# EAGLE schematic RGB_matrixDriver-v2.0 (EAGLE 7.3.0)
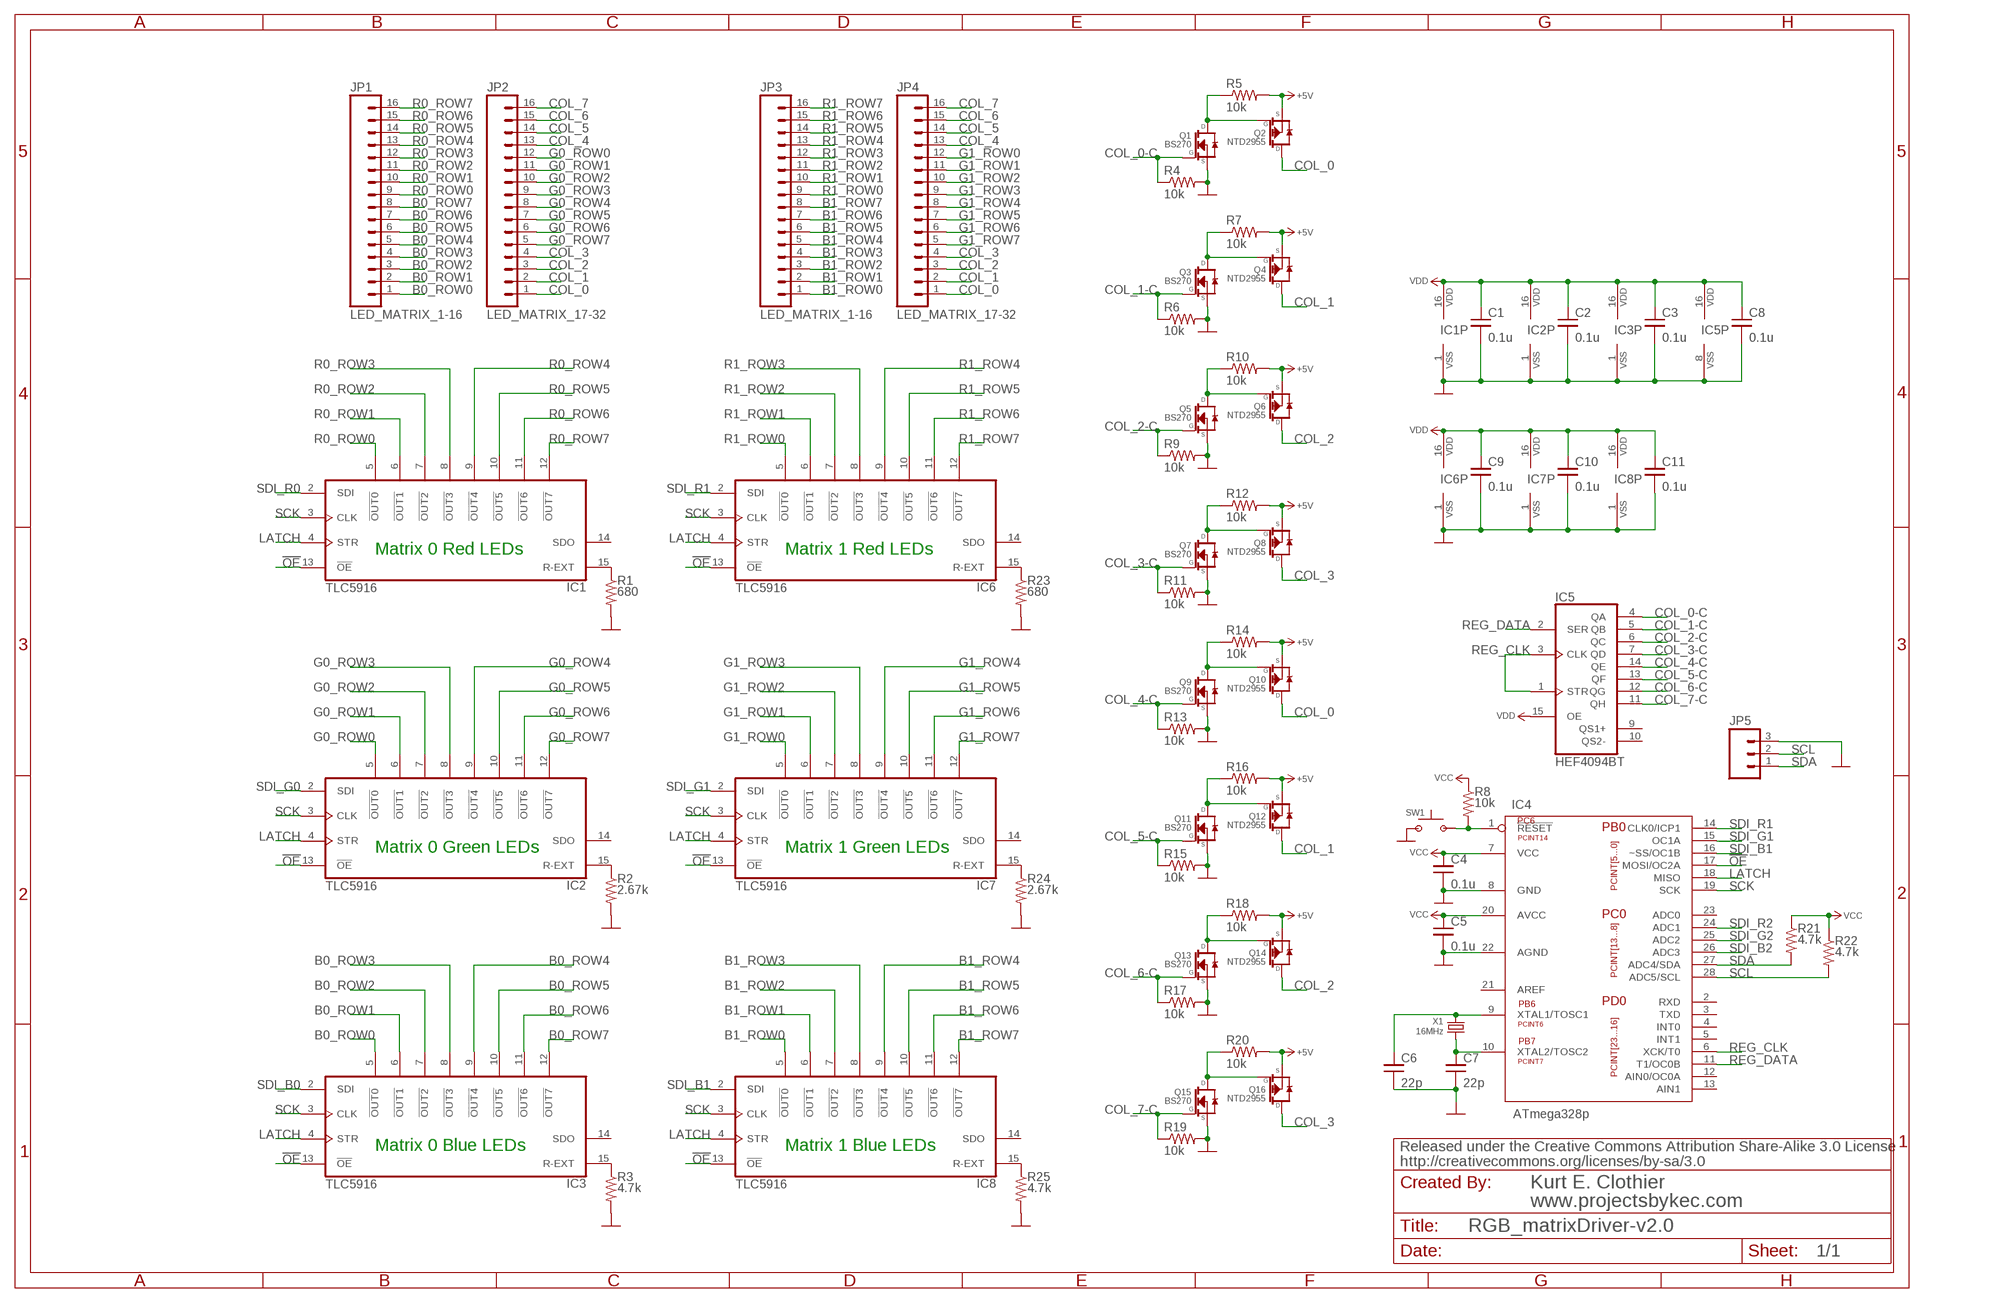
[diagram p0: schematic, sheet 1]

## Parts
C1  0.1u  CAPACITOR-0805  [0805]
C2  0.1u  CAPACITOR-0805  [0805]
C3  0.1u  CAPACITOR-0805  [0805]
C4  0.1u  CAPACITOR-0805  [0805]
C5  0.1u  CAPACITOR-0805  [0805]
C6  22p  CAPACITOR-0805  [0805]
C7  22p  CAPACITOR-0805  [0805]
C8  0.1u  CAPACITOR-0805  [0805]
C9  0.1u  CAPACITOR-0805  [0805]
C10  0.1u  CAPACITOR-0805  [0805]
C11  0.1u  CAPACITOR-0805  [0805]
IC1  TLC5916  TLC591XBT  [SO16]
IC2  TLC5916  TLC591XBT  [SO16]
IC3  TLC5916  TLC591XBT  [SO16]
IC4  ATmega328p  MEGA48/88/168/328-PU-SOCKET  [28P3-SOCKET]
IC5  HEF4094BT  [SO16]
IC6  TLC5916  TLC591XBT  [SO16]
IC7  TLC5916  TLC591XBT  [SO16]
IC8  TLC5916  TLC591XBT  [SO16]
JP1  LED_MATRIX_1-16  M16LOCK_LONGPADS  [1X16_LOCK_LONGPADS]
JP2  LED_MATRIX_17-32  M16LOCK_LONGPADS  [1X16_LOCK_LONGPADS]
JP3  LED_MATRIX_1-16  M16LOCK_LONGPADS  [1X16_LOCK_LONGPADS]
JP4  LED_MATRIX_17-32  M16LOCK_LONGPADS  [1X16_LOCK_LONGPADS]
JP5  M03LOCK  [1X03_LOCK]
Q1  BS270  [TO-92]
Q2  NTD2955  [TO-251_(IPAK)]
Q3  BS270  [TO-92]
Q4  NTD2955  [TO-251_(IPAK)]
Q5  BS270  [TO-92]
Q6  NTD2955  [TO-251_(IPAK)]
Q7  BS270  [TO-92]
Q8  NTD2955  [TO-251_(IPAK)]
Q9  BS270  [TO-92]
Q10  NTD2955  [TO-251_(IPAK)]
Q11  BS270  [TO-92]
Q12  NTD2955  [TO-251_(IPAK)]
Q13  BS270  [TO-92]
Q14  NTD2955  [TO-251_(IPAK)]
Q15  BS270  [TO-92]
Q16  NTD2955  [TO-251_(IPAK)]
R1  680  RESISTOR-V-0805  [0805]
R2  2.67k  RESISTOR-V-0805  [0805]
R3  4.7k  RESISTOR-V-0805  [0805]
R4  10k  RESISTOR-0805  [0805]
R5  10k  RESISTOR-0805  [0805]
R6  10k  RESISTOR-0805  [0805]
R7  10k  RESISTOR-0805  [0805]
R8  10k  RESISTOR-V-0805  [0805]
R9  10k  RESISTOR-0805  [0805]
R10  10k  RESISTOR-0805  [0805]
R11  10k  RESISTOR-0805  [0805]
R12  10k  RESISTOR-0805  [0805]
R13  10k  RESISTOR-0805  [0805]
R14  10k  RESISTOR-0805  [0805]
R15  10k  RESISTOR-0805  [0805]
R16  10k  RESISTOR-0805  [0805]
R17  10k  RESISTOR-0805  [0805]
R18  10k  RESISTOR-0805  [0805]
R19  10k  RESISTOR-0805  [0805]
R20  10k  RESISTOR-0805  [0805]
R21  4.7k  RESISTOR-V-0805  [0805]
R22  4.7k  RESISTOR-V-0805  [0805]
R23  680  RESISTOR-V-0805  [0805]
R24  2.67k  RESISTOR-V-0805  [0805]
R25  4.7k  RESISTOR-V-0805  [0805]
SW1  SPST_OFF-MOM-TACTILE-PTH  [TACTILE-PTH]
X1  16MHz  CRYSTALSMD-10.5X4.8  [CRYSTAL-SMD-10.5X4.8-2PIN]

## Nets
!OE: IC1.13(!OE) IC2.13(!OE) IC3.13(!OE) IC4.17(MOSI/OC2A) IC6.13(!OE) IC7.13(!OE) IC8.13(!OE)
+5V: Q2.3(S) Q4.3(S) Q6.3(S) Q8.3(S) Q10.3(S) Q12.3(S) Q14.3(S) Q16.3(S) R5.2 R7.2 R10.2 R12.2 R14.2 R16.2 R18.2 R20.2
B0_ROW0: IC3.5(!OUT0) JP1.1
B0_ROW1: IC3.6(!OUT1) JP1.2
B0_ROW2: IC3.7(!OUT2) JP1.3
B0_ROW3: IC3.8(!OUT3) JP1.4
B0_ROW4: IC3.9(!OUT4) JP1.5
B0_ROW5: IC3.10(!OUT5) JP1.6
B0_ROW6: IC3.11(!OUT6) JP1.7
B0_ROW7: IC3.12(!OUT7) JP1.8
B1_ROW0: IC8.5(!OUT0) JP3.1
B1_ROW1: IC8.6(!OUT1) JP3.2
B1_ROW2: IC8.7(!OUT2) JP3.3
B1_ROW3: IC8.8(!OUT3) JP3.4
B1_ROW4: IC8.9(!OUT4) JP3.5
B1_ROW5: IC8.10(!OUT5) JP3.6
B1_ROW6: IC8.11(!OUT6) JP3.7
B1_ROW7: IC8.12(!OUT7) JP3.8
COL_0: JP2.1 JP4.1 Q2.2(D) Q10.2(D)
COL_0-C: IC5.4(QA) Q1.2(G) R4.1
COL_1: JP2.2 JP4.2 Q4.2(D) Q12.2(D)
COL_1-C: IC5.5(QB) Q3.2(G) R6.1
COL_2: JP2.3 JP4.3 Q6.2(D) Q14.2(D)
COL_2-C: IC5.6(QC) Q5.2(G) R9.1
COL_3: JP2.4 JP4.4 Q8.2(D) Q16.2(D)
COL_3-C: IC5.7(QD) Q7.2(G) R11.1
COL_4: JP2.13 JP4.13
COL_4-C: IC5.14(QE) Q9.2(G) R13.1
COL_5: JP2.14 JP4.14
COL_5-C: IC5.13(QF) Q11.2(G) R15.1
COL_6: JP2.15 JP4.15
COL_6-C: IC5.12(QG) Q13.2(G) R17.1
COL_7: JP2.16 JP4.16
COL_7-C: IC5.11(QH) Q15.2(G) R19.1
G0_ROW0: IC2.5(!OUT0) JP2.12
G0_ROW1: IC2.6(!OUT1) JP2.11
G0_ROW2: IC2.7(!OUT2) JP2.10
G0_ROW3: IC2.8(!OUT3) JP2.9
G0_ROW4: IC2.9(!OUT4) JP2.8
G0_ROW5: IC2.10(!OUT5) JP2.7
G0_ROW6: IC2.11(!OUT6) JP2.6
G0_ROW7: IC2.12(!OUT7) JP2.5
G1_ROW0: IC7.5(!OUT0) JP4.12
G1_ROW1: IC7.6(!OUT1) JP4.11
G1_ROW2: IC7.7(!OUT2) JP4.10
G1_ROW3: IC7.8(!OUT3) JP4.9
G1_ROW4: IC7.9(!OUT4) JP4.8
G1_ROW5: IC7.10(!OUT5) JP4.7
G1_ROW6: IC7.11(!OUT6) JP4.6
G1_ROW7: IC7.12(!OUT7) JP4.5
GND-D: C1.2 C2.2 C3.2 C4.2 C5.2 C6.2 C7.2 C8.2 C9.2 C10.2 C11.2 IC1.1(VSS) IC2.1(VSS) IC3.1(VSS) IC4.8(GND) IC4.22(AGND) IC5.8(VSS) IC6.1(VSS) IC7.1(VSS) IC8.1(VSS) Q1.3(S) Q3.3(S) Q5.3(S) Q7.3(S) Q9.3(S) Q11.3(S) Q13.3(S) Q15.3(S) R1.2 R2.2 R3.2 R4.2 R6.2 R9.2 R11.2 R13.2 R15.2 R17.2 R19.2 R23.2 R24.2 R25.2 SW1.1 SW1.2 ; supply symbol labelled GND-DIGITAL
LATCH: IC1.4(STR) IC2.4(STR) IC3.4(STR) IC4.18(MISO) IC6.4(STR) IC7.4(STR) IC8.4(STR)
N$1: IC3.15(R-EXT) R3.1
N$2: Q1.1(D) Q2.1(G) R5.1
N$3: IC2.15(R-EXT) R2.1
N$4: Q3.1(D) Q4.1(G) R7.1
N$5: IC1.15(R-EXT) R1.1
N$6: Q5.1(D) Q6.1(G) R10.1
N$7: Q7.1(D) Q8.1(G) R12.1
N$8: Q9.1(D) Q10.1(G) R14.1
N$9: C6.1 IC4.9(XTAL1/TOSC1) X1.P$2
N$10: IC4.1(!RESET) R8.2 SW1.3 SW1.4
N$11: IC6.15(R-EXT) R23.1
N$12: IC7.15(R-EXT) R24.1
N$13: IC8.15(R-EXT) R25.1
N$14: JP5.3 ; supply symbol labelled GND-DIGITAL
N$15: C7.1 IC4.10(XTAL2/TOSC2) X1.P$1
N$17: Q11.1(D) Q12.1(G) R16.1
N$18: Q13.1(D) Q14.1(G) R18.1
N$19: Q15.1(D) Q16.1(G) R20.1
R0_ROW0: IC1.5(!OUT0) JP1.9
R0_ROW1: IC1.6(!OUT1) JP1.10
R0_ROW2: IC1.7(!OUT2) JP1.11
R0_ROW3: IC1.8(!OUT3) JP1.12
R0_ROW4: IC1.9(!OUT4) JP1.13
R0_ROW5: IC1.10(!OUT5) JP1.14
R0_ROW6: IC1.11(!OUT6) JP1.15
R0_ROW7: IC1.12(!OUT7) JP1.16
R1_ROW0: IC6.5(!OUT0) JP3.9
R1_ROW1: IC6.6(!OUT1) JP3.10
R1_ROW2: IC6.7(!OUT2) JP3.11
R1_ROW3: IC6.8(!OUT3) JP3.12
R1_ROW4: IC6.9(!OUT4) JP3.13
R1_ROW5: IC6.10(!OUT5) JP3.14
R1_ROW6: IC6.11(!OUT6) JP3.15
R1_ROW7: IC6.12(!OUT7) JP3.16
REG_CLK: IC4.6(XCK/T0) IC5.1(STR) IC5.3(CLK)
REG_DATA: IC4.11(T1/OC0B) IC5.2(SER)
SCK: IC1.3(CLK) IC2.3(CLK) IC3.3(CLK) IC4.19(SCK) IC6.3(CLK) IC7.3(CLK) IC8.3(CLK)
SCL: IC4.28(ADC5/SCL) JP5.2 R22.2
SDA: IC4.27(ADC4/SDA) JP5.1 R21.2
SDI_B0: IC3.2(SDI)
SDI_B1: IC4.16(~SS/OC1B) IC8.2(SDI)
SDI_B2: IC4.26(ADC3)
SDI_G0: IC2.2(SDI)
SDI_G1: IC4.15(OC1A) IC7.2(SDI)
SDI_G2: IC4.25(ADC2)
SDI_R0: IC1.2(SDI)
SDI_R1: IC4.14(CLK0/ICP1) IC6.2(SDI)
SDI_R2: IC4.24(ADC1)
VCC: C4.1 C5.1 IC4.7(VCC) IC4.20(AVCC) R8.1 R21.1 R22.1
VDD: C1.1 C2.1 C3.1 C8.1 C9.1 C10.1 C11.1 IC1.16(VDD) IC2.16(VDD) IC3.16(VDD) IC5.15(OE) IC5.16(VDD) IC6.16(VDD) IC7.16(VDD) IC8.16(VDD)
Unconnected: IC1.14(SDO) IC2.14(SDO) IC3.14(SDO) IC4.2(RXD) IC4.3(TXD) IC4.4(INT0) IC4.5(INT1) IC4.12(AIN0/OC0A) IC4.13(AIN1) IC4.21(AREF) IC4.23(ADC0) IC5.9(QS1+) IC5.10(QS2-) IC6.14(SDO) IC7.14(SDO) IC8.14(SDO)

## Notes on the sheet
- Matrix 0 Red LEDs | Matrix 1 Red LEDs
- Matrix 0 Green LEDs | Matrix 1 Green LEDs
- Matrix 0 Blue LEDs | Matrix 1 Blue LEDs

## Library data of the parts
C1-C11 = Passive Components:CAPACITOR: CAPACITOR - Vertical Alignment Basic schematic elements and footprints for non-polarized surface mount and through hole capacitors.
IC1-IC3 IC6-IC8 = Drivers:TLC591X: Constant Current LED Sink Driver 8 Bits 120mA / channel Created by: Kurt E. Clothier July 16, 2015
IC4 = Atmel:MEGA48/88/168/328-PU: Atmel AVR 28 Pin MICROCONTROLLER Data obtained from Atmel 8bit AVR.pdf ATmega48A/PA, ATmega88A/PA, ATmega168A/PA, ATmega328/P Featuers Include: 4/8/16/32 K Bytes FLASH 512/1K/1K/2K Bytes RAM 256/512/512/1K Bytes EEPROM USART, SPI, I2C 6-channel 10 bit ADC Two 8-bit Timers One 16-bit Timer Six PWM Channels 20 MHz 1.8 - 5.5 V Supply -40*C to 85*C Industrail Range Packages: 32A - 32-lead, Thin (1.0 mm) Plastic Quad Flat Package (TQFP) 28P3 - 28-lead, 0.300" Wide, Plastic Dual Inline Package (PDIP) 32M1-A - 32-pad, 5x5x1.0 body, Lead Picth 0.50 mm Wuad Flat No-Lead/Mirco Lead Frame Package (QFN/MLF) Created by Kurt E. Clothier, 3/24/2011 www.projectsbykec.com
IC5 = Registers:HEF4094: 8 bit shift and store register
JP1-JP4 = Connectors:M16
JP5 = Connectors:M03: Header 3 Standard 3-pin 0.1" header. Use with straight break away headers (SKU : PRT-00116), right angle break away headers (PRT-00553), swiss pins (PRT-00743), machine pins (PRT-00117), and female headers (PRT-00115). Molex polarized connector foot print use with SKU : PRT-08232 with associated crimp pins and housings.
Q1 Q3 Q5 Q7 Q9 Q11 Q13 Q15 = Transistor-FET:BS270: N Channel Enhancement Mode FET
Q2 Q4 Q6 Q8 Q10 Q12 Q14 Q16 = Transistor-FET:NTD2955: P Channel Power MOSFET
R1-R3 R8 R21-R25 = Passive Components:RESISTOR-V: RESISTOR - Vertical Alignment Basic schematic elements and footprints for surface mount and through hole resistors.
R4-R7 R9-R20 = Passive Components:RESISTOR: RESISTOR - Horizontal Alignment Basic schematic elements and footprints for surface mount and through hole resistors.
SW1 = Switches:SPST_OFF-MOM: Switch Circuit: Single Pole, Single Throw Function: OFF-MOM
X1 = Crystals and Oscillators:CRYSTAL: Crystal Various standard crystals.